# Altium schematic sheet MSWC_Top.SchDoc
size A4
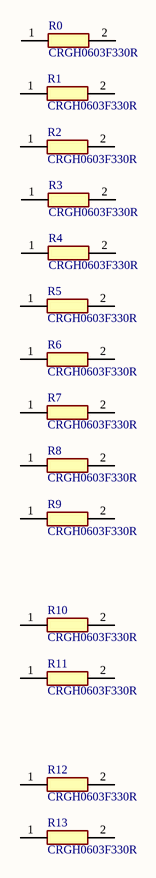
[diagram p0: MSWC_Top.SchDoc]

## Parts
R0  CRGH0603F330R  [RESC1608X55N]
R1  CRGH0603F330R  [RESC1608X55N]
R2  CRGH0603F330R  [RESC1608X55N]
R3  CRGH0603F330R  [RESC1608X55N]
R4  CRGH0603F330R  [RESC1608X55N]
R5  CRGH0603F330R  [RESC1608X55N]
R6  CRGH0603F330R  [RESC1608X55N]
R7  CRGH0603F330R  [RESC1608X55N]
R8  CRGH0603F330R  [RESC1608X55N]
R9  CRGH0603F330R  [RESC1608X55N]
R10  CRGH0603F330R  [RESC1608X55N]
R11  CRGH0603F330R  [RESC1608X55N]
R12  CRGH0603F330R  [RESC1608X55N]
R13  CRGH0603F330R  [RESC1608X55N]

## Nets

Not connected (* = marked no-connect by the designer): R0 1 2; R1 1 2; R2 1 2; R3 1 2; R4 1 2; R5 1 2; R6 1 2; R7 1 2; R8 1 2; R9 1 2; R10 1 2; R11 1 2; R12 1 2; R13 1 2

## Library data of the parts
R0-R13 = CRGH0603F330R: Resistor; Manufacturer_Name: TE Connectivity; Height: 0.55mm; Manufacturer_Part_Number: CRGH0603F330R